# EAGLE design module-mp7740 (EAGLE 7.7.0)
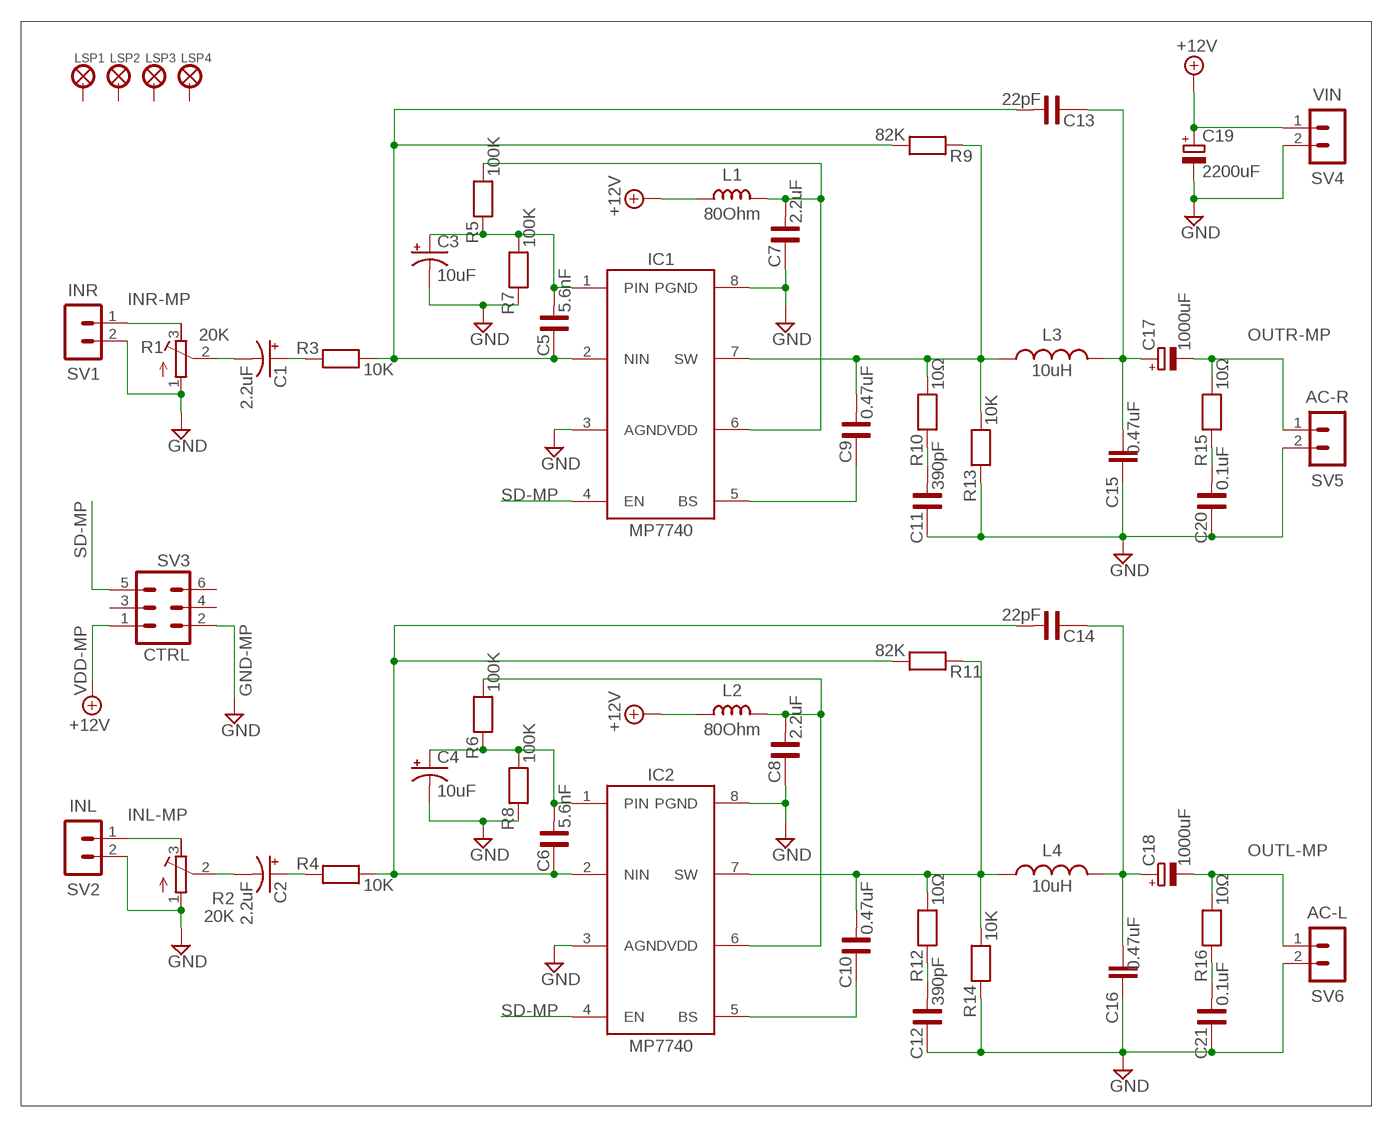
[diagram p0: schematic, sheet 1]

## Parts
C1  2.2uF  CPOL-USE2-5  [E2-5]
C2  2.2uF  CPOL-USE2-5  [E2-5]
C3  10uF  CPOL-USE2-5  [E2-5]
C4  10uF  CPOL-USE2-5  [E2-5]
C5  5.6nF  C-US0805  [C0805]
C6  5.6nF  C-US0805  [C0805]
C7  2.2uF  C-US1206  [C1206]
C8  2.2uF  C-US1206  [C1206]
C9  0.47uF  C-US0805  [C0805]
C10  0.47uF  C-US0805  [C0805]
C11  390pF  C-US0805  [C0805]
C12  390pF  C-US0805  [C0805]
C13  22pF  C-US0805  [C0805]
C14  22pF  C-US0805  [C0805]
C15  0.47uF  C-EU050-050X075  [C050-050X075]
C16  0.47uF  C-EU050-050X075  [C050-050X075]
C17  1000uF  CPOL-EUE5-13  [E5-13]
C18  1000uF  CPOL-EUE5-13  [E5-13]
C19  2200uF  CPOL-EUE7.5-16  [E7,5-16]
C20  0.1uF  C-US0805  [C0805]
C21  0.1uF  C-US0805  [C0805]
IC1  MP7740  [SOIC-8]
IC2  MP7740  [SOIC-8]
L1  80Ohm  L-USL0805  [L0805]
L2  80Ohm  L-USL0805  [L0805]
L3  10uH  L-US6000-XXX-RC  [6000-XXXX-RC]
L4  10uH  L-US6000-XXX-RC  [6000-XXXX-RC]
LSP1  LSP27  [LSP27]
LSP2  LSP27  [LSP27]
LSP3  LSP27  [LSP27]
LSP4  LSP27  [LSP27]
R1  20K  PV32H  [PV32H]
R2  20K  PV32H  [PV32H]
R3  10K  R-US0805  [R0805]
R4  10K  R-US0805  [R0805]
R5  100K  R-US0805  [R0805]
R6  100K  R-US0805  [R0805]
R7  100K  R-US0805  [R0805]
R8  100K  R-US0805  [R0805]
R9  82K  R-US0805  [R0805]
R10  10Ω  R-US0805  [R0805]
R11  82K  R-US0805  [R0805]
R12  10Ω  R-US0805  [R0805]
R13  10K  R-US0805  [R0805]
R14  10K  R-US0805  [R0805]
R15  10Ω  R-US0805  [R0805]
R16  10Ω  R-US0805  [R0805]
SV1  INR  MA02-1GREEN  [MA02-1-GREEN]
SV2  INL  MA02-1GREEN  [MA02-1-GREEN]
SV3  CTRL  MA03-2PL  [MA03-2]
SV4  VIN  MA02-1GREEN  [MA02-1-GREEN]
SV5  AC-R  MA02-1GREEN  [MA02-1-GREEN]
SV6  AC-L  MA02-1GREEN  [MA02-1-GREEN]

## Nets
GND-MP: C3.- C4.- C7.1 C8.1 C11.1 C12.1 C15.1 C16.1 C19.- C20.1 C21.1 IC1.3(AGND) IC1.8(PGND) IC2.3(AGND) IC2.8(PGND) R1.1 R2.1 R7.1 R8.1 R13.1 R14.1 SV1.2 SV2.2 SV3.2 SV4.2 SV5.2 SV6.2 ; supply symbol labelled GND
INL-MP: R2.3 SV2.1
INR-MP: R1.3 SV1.1
N$1: C5.1 C13.2 IC1.2(NIN) R3.2 R9.2
N$2: C1.+ R3.1
N$3: C1.- R1.2
N$4: C9.2 IC1.7(SW) L3.1 R9.1 R10.2 R13.2
N$5: C9.1 IC1.5(BS)
N$6: C11.2 R10.1
N$7: C13.1 C15.2 C17.+ L3.2
N$8: C20.2 R15.1
N$9: C6.1 C14.2 IC2.2(NIN) R4.2 R11.2
N$10: C3.+ C5.2 IC1.1(PIN) R5.1 R7.2
N$11: C2.+ R4.1
N$13: C10.2 IC2.7(SW) L4.1 R11.1 R12.2 R14.2
N$24: C10.1 IC2.5(BS)
N$25: C12.2 R12.1
N$26: C14.1 C16.2 C18.+ L4.2
N$28: C21.2 R16.1
N$29: C4.+ C6.2 IC2.1(PIN) R6.1 R8.2
N$31: C2.- R2.2
OUTL-MP: C18.- R16.2 SV6.1
OUTR-MP: C17.- R15.2 SV5.1
SD-MP: IC1.4(EN) IC2.4(EN) SV3.5
VCCL: C8.2 IC2.6(VDD) L2.2 R6.2
VCCR: C7.2 IC1.6(VDD) L1.2 R5.2
VDD-MP: C19.+ L1.1 L2.1 SV3.1 SV4.1 ; supply symbol labelled +12V
Unconnected: LSP1.MP LSP2.MP LSP3.MP LSP4.MP SV3.3 SV3.4 SV3.6

## Library data of the parts
C1-C4 = MyComponents:CPOL-US: SMT Tantalum Capacitor
C5 C6 C9-C14 C20 C21 = MyComponents:C-US: SMD Multilayer Ceramic Capacitor; MOUSER: 80-C0805C104J5RAUTO
C7 C8 = MyComponents:C-US: SMD Multilayer Ceramic Capacitor
C15 C16 = rcl:C-EU: CAPACITOR, European symbol
C17-C19 = rcl:CPOL-EU: POLARIZED CAPACITOR, European symbol
IC1 IC2 = MyComponents:MP7740: MP7740 15W Class D Mono Single Ended Audio Amplifer; MOUSER: 946-MP7740DNLFZ
L1 L2 = MyComponents:L-US: SMD Ferrite Bead; MOUSER: 963-CKP2012N1R0M-T
L3 L4 = rcl:L-US: INDUCTOR, American symbol
LSP1-LSP4 = MyComponents:LSP27: Solder Pad, drill 2.75 mm
R1 R2 = MyComponents:PV32H: BOURNS Trimmer Potentiometers Lead Sealed Type Single-turn PV32 Series
R3-R16 = MyComponents:R-US: SMD Resistor; MOUSER: 660-RK73H2ATTDD1R00F
SV1 SV2 SV4-SV6 = MyComponents:MA02-1: Headers & Wire Housing, 1 Row, 3 Position
SV3 = MyComponents:MA03-2: Headers & Wire Housing, 2 Row, 6 Position

## Board
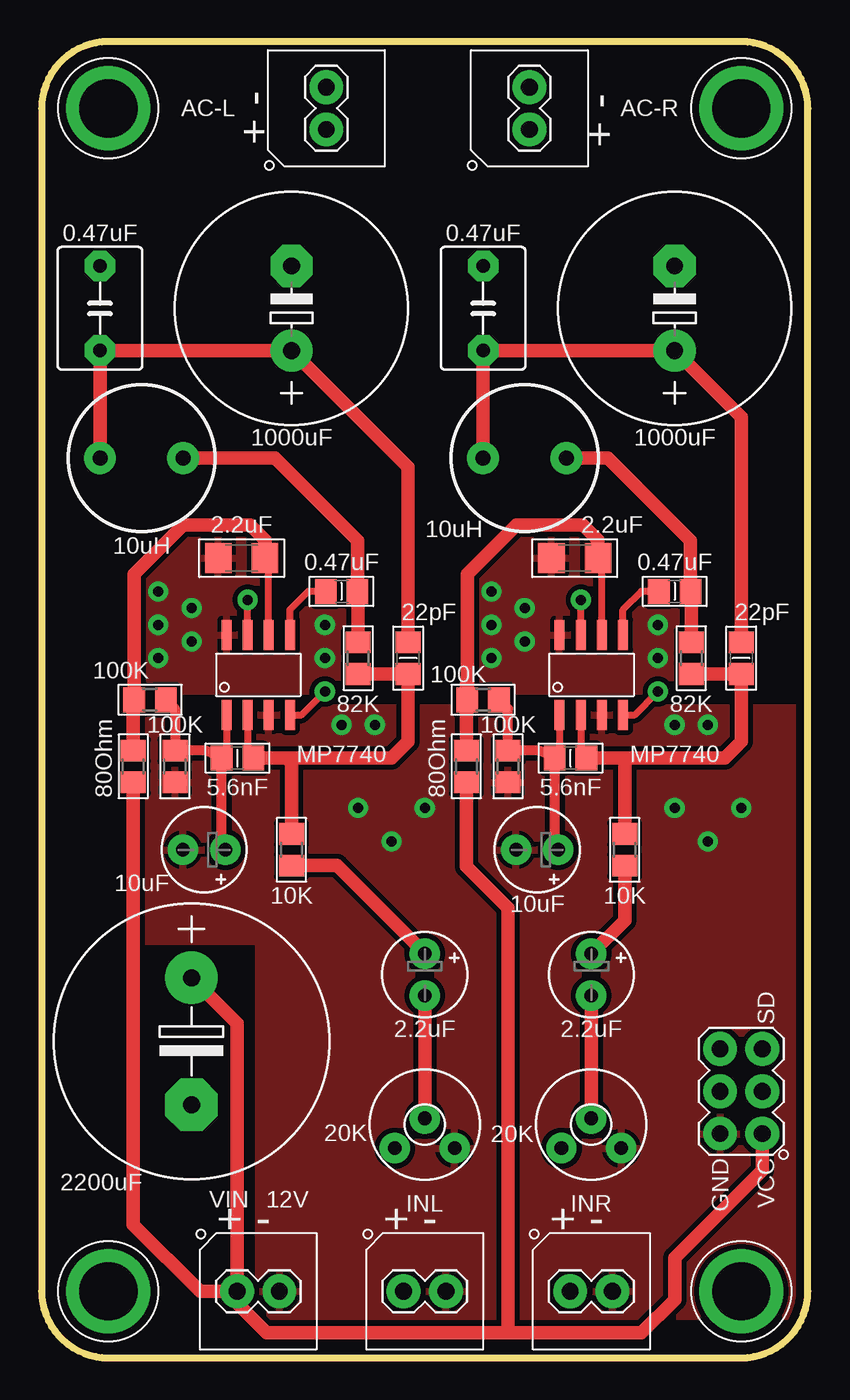
[diagram p1: board, top side]
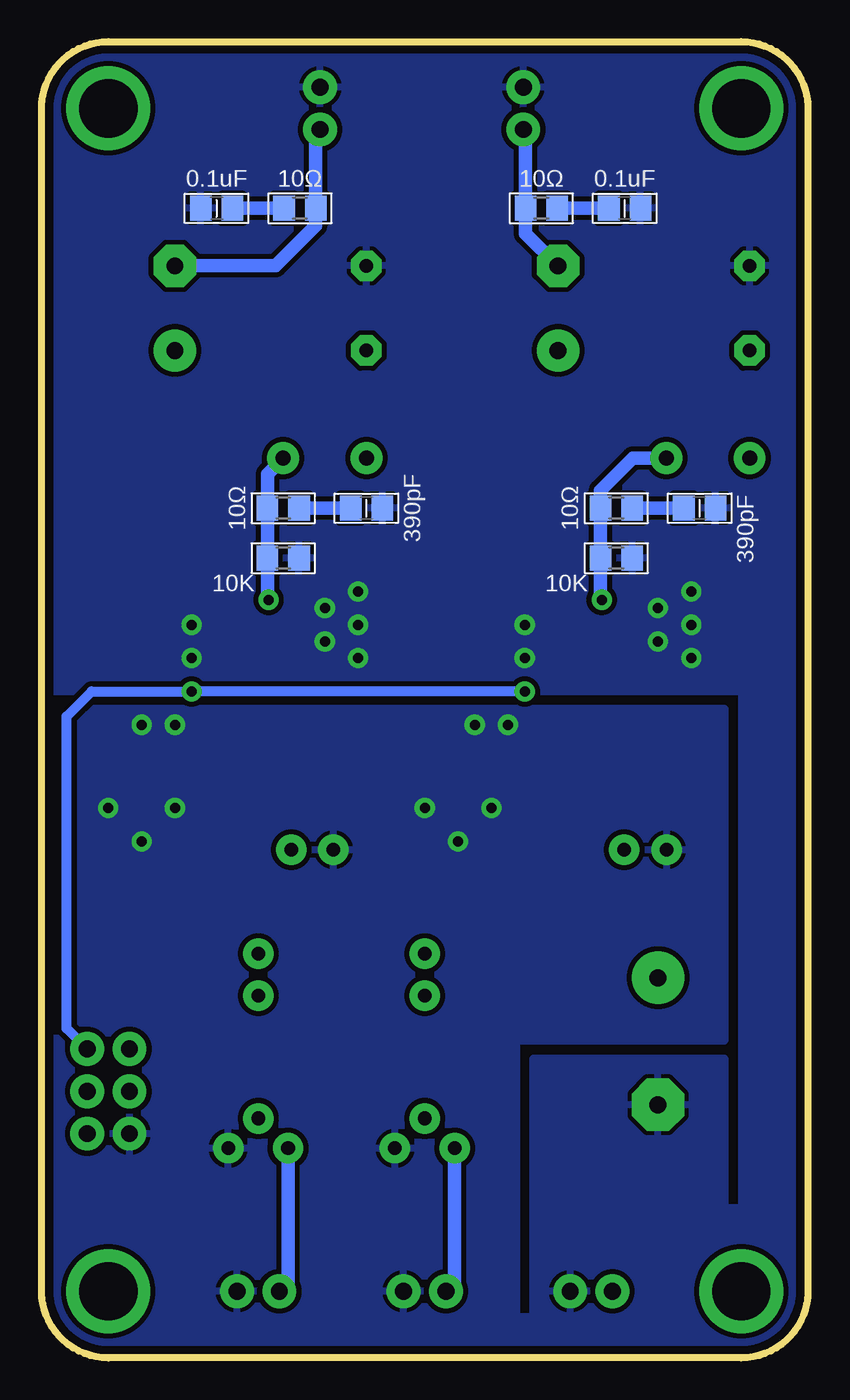
[diagram p2: board, bottom side, seen from below]

Size 46 x 79 mm. Coordinates in mm from the lower left corner, seen from the top.
Outline: 0,4 arc90 4,0 42,0 arc90 46,4 46,75 arc90 42,79 4,79 arc90 0,75 0,4
Copper layers (1*16): Top 0.035mm / dielectric 1.5mm / Bottom 0.035mm
Design rules "analog": minimum track width 15mil, minimum drill 19mil, track to track 12mil, track to pad 12mil, pad to pad 12mil, via to via 12mil, smd to smd 8mil, copper to edge 20mil, drill to drill 40mil, minimum pad ring 20mil, minimum via ring 12mil, stop-mask expansion 1mil, vias tented up to drill 0mil, thermal gap 10mil

### Footprints (pad centres in the part's own frame; a part is rotated, then mirrored left to right if it is on the bottom)
E2-5 = drill 0.813: + -1.27,0; - 1.27,0
C0805 = smd 1.3 x 1.5: 1 -0.95,0; 2 0.95,0
C1206 = smd 1.6 x 1.8: 1 -1.4,0; 2 1.4,0
C050-050X075 = drill 0.813 octagon: 1 -2.54,0; 2 2.54,0
E5-13 = drill 1.016 pad 2.54: + -2.54,0 | drill 1.016 pad 2.54 octagon: - 2.54,0
E7,5-16 = drill 1.016 pad 3.15: + -3.81,0 | drill 1.016 pad 3.15 octagon: - 3.81,0
SOIC-8 = smd 0.6 x 1.8: 1 -1.905,-2.4; 2 -0.635,-2.4; 3 0.635,-2.4; 4 1.905,-2.4; 5 1.905,2.4; 6 0.635,2.4; 7 -0.635,2.4; 8 -1.905,2.4
L0805 = smd 1.3 x 1.5: 1 -0.95,0; 2 0.95,0
6000-XXXX-RC = drill 0.9 pad 1.422: 1 -2.5,0; 2 2.5,0
LSP27 = drill 3.5 pad 5: MP 0,0
PV32H = drill 0.813: 1 1.798,-1.422; 2 0,0.374; 3 -1.794,-1.422
R0805 = smd 1.3 x 1.5: 1 -0.95,0; 2 0.95,0
MA02-1-GREEN = drill 1.016: 1 -1.27,0; 2 1.27,0
MA03-2 = drill 1.016: 1 -2.54,-1.27; 2 -2.54,1.27; 3 0,-1.27; 4 0,1.27; 5 2.54,-1.27; 6 2.54,1.27

### Placement (x,y rotation side)
C1  33,23 270 top
C2  23,23 270 top
C3  29.75,30.5 180 top
C4  9.75,30.5 180 top
C5  31.75,36 180 top
C6  11.75,36 180 top
C7  32,48 0 top
C8  12,48 0 top
C9  38,46 0 top
C10  18,46 0 top
C11  26.5,51 180 bottom
C12  6.5,51 180 bottom
C13  42,42 270 top
C14  22,42 270 top
C15  26.5,63 270 top
C16  3.5,63 270 top
C17  38,63 90 top
C18  15,63 90 top
C19  9,19 270 top
C20  35.5,69 0 bottom
C21  11,69 180 bottom
IC1  33,41 0 top
IC2  13,41 0 top
L1  25.5,35.5 90 top
L2  5.5,35.5 90 top
L3  29,54 180 top
L4  6,54 180 top
LSP1  4,75 0 top
LSP2  42,75 0 top
LSP3  42,4 0 top
LSP4  4,4 0 top
R1  33,14 0 top
R2  23,14 0 top
R3  35,30.5 90 top
R4  15,30.5 90 top
R5  26.5,39.5 180 top
R6  6.5,39.5 180 top
R7  28,35.5 90 top
R8  8,35.5 90 top
R9  39,42 270 top
R10  31.5,51 180 bottom
R11  19,42 270 top
R12  11.5,51 180 bottom
R13  31.5,48 180 bottom
R14  11.5,48 180 bottom
R15  30.5,69 0 bottom
R16  16,69 180 bottom
SV1  33,4 0 top
SV2  23,4 0 top
SV3  42,16 90 top
SV4  13,4 0 top
SV5  29.28,75 90 top
SV6  17.09,75 90 top

### Tracks (layer width: path | path; a pad name or v marks a point on that pad's centre or on a via)
GND-MP  (via drill 0.6)
  other vias: 7,46 7,44 7,42 9,43 9,45 17,44 17,42 27,44 27,46 27,42 29,43 29,45 37,44 37,42 18,38 20,38 38,38 40,38 19,33 23,33 21,31 38,33 42,33 40,31
  pour Bottom: 46,40 4,40 4,9 16,9 16,0 0,0 0,79 46,79
  pour Top: 46,40 0,40 0,50 46,50
  pour Bottom: 16.5,0 16.5,18 5,18 5,0
  pour Bottom: 13,0 46,0 46,39 5,39 5,19 17.5,19 17.5,2.5 13,2.5
  pour Top: 13,25 13,2.5 46,2.5 46,39 5,39 5,25
INL-MP
  Bottom 0.813: R2.3 21.21,4.52 SV2.1
INR-MP
  Bottom 0.813: R1.3 31.21,4.52 SV1.1
N$1
  Top 0.406: IC1.2 32.37,36.34 C5.1
  Top 0.813: R9.2 C13.2 42,37 41,36 35,36 | 35,36 C5.1 | R3.2 35,36
N$2
  Top 0.813: R3.1 35,26.27 C1.+
N$3
  Top 0.813: C1.- R1.2
N$4  (via drill 0.6)
  Top 0.406: IC1.7 32.37,45.24 v32.38,45.5
  Top 0.813: R9.1 39,45.95 C9.2 38.95,49.05 34,54 L3.1
  Bottom 0.813: L3.1 32.45,53.05 R10.2 R13.2 32.45,45.33 v32.38,45.5
N$5
  Top 0.406: C9.1 36,46 34.91,44.91 IC1.5
N$6
  Bottom 0.813: R10.1 C11.2
N$7
  Top 0.813: L3.2 C15.2 C17.+ 42,56.46 C13.1
N$8
  Bottom 0.813: R15.1 C20.2
N$9
  Top 0.406: IC2.2 12.37,36.34 C6.1
  Top 0.813: R11.2 C14.2 22,37 21,36 14.75,36 | C6.1 14.75,36 | R4.2 15,35.75 14.75,36
N$10
  Top 0.406: IC1.1 31.09,36.3 C5.2
  Top 0.61: R5.1 28,38.95 R7.2 29.85,36.45 C5.2 30.8,30.72 C3.+
N$11
  Top 0.813: C2.+ 17.72,29.55 R4.1
N$13  (via drill 0.6)
  Top 0.406: IC2.7 12.37,45.24 v12.38,45.5
  Top 0.813: R11.1 19,45.95 C10.2 18.95,49.05 14,54 L4.1
  Bottom 0.813: v12.38,45.5 12.45,45.33 R14.2 R12.2 12.45,52.05 10.5,54 L4.1
N$24
  Top 0.406: C10.1 16,46 14.9,44.91 IC2.5
N$25
  Bottom 0.813: R12.1 C12.2
N$26
  Top 0.813: L4.2 C16.2 C18.+ 22,53.46 C14.1
N$28
  Bottom 0.813: R16.1 C21.2
N$29
  Top 0.406: IC2.1 11.1,36.3 C6.2
  Top 0.61: R6.1 8,38.95 R8.2 9.85,36.45 C6.2 10.8,30.72 C4.+
N$31
  Top 0.813: C2.- R2.2
OUTL-MP
  Bottom 0.813: SV6.1 16.95,73.73 R16.2 16.95,67.49 C18.-
OUTR-MP
  Bottom 0.813: SV5.1 arc-90 29.55,73.46 R15.2 29.55,67.95 31.96,65.54 C17.-
SD-MP  (via drill 0.6)
  Top 0.406: IC1.4 35.6,38.6 v37,40 | IC2.4 15.6,38.6 v17,40
  Bottom 0.61: v17,40 v37,40 43,40 44.5,38.5 44.5,19.77 SV3.5
VCCL
  Top 0.406: IC2.6 13.63,47.77 C8.2
  Top 0.813: C8.2 13.4,49.1 12.5,50 8.5,50 5.55,47.05 R6.2 5.5,39.95 L2.2
VCCR
  Top 0.406: IC1.6 33.63,47.77 C7.2
  Top 0.813: R5.2 25.55,40.5 | 25.55,40.5 25.55,47.05 28.5,50 32.5,50 33.4,49.1 C7.2 | L1.2 25.5,40.45 25.55,40.5
VDD-MP
  Top 0.813: C19.+ 11.73,20.08 SV4.1 | L2.1 5.5,8 9.5,4 SV4.1 | SV3.1 43.27,11.27 38,6 38,3.5 36,1.5 28,1.5 | 28,1.5 13.5,1.5 11.73,3.27 SV4.1 | L1.1 25.5,29.5 28,27 28,1.5

### Text on the board
tPlace: + - | + - | + - | + - | + -
tNames: SD | GND | VCC | 12V